# EAGLE design inav-7.1_fc (EAGLE 9.6.2)
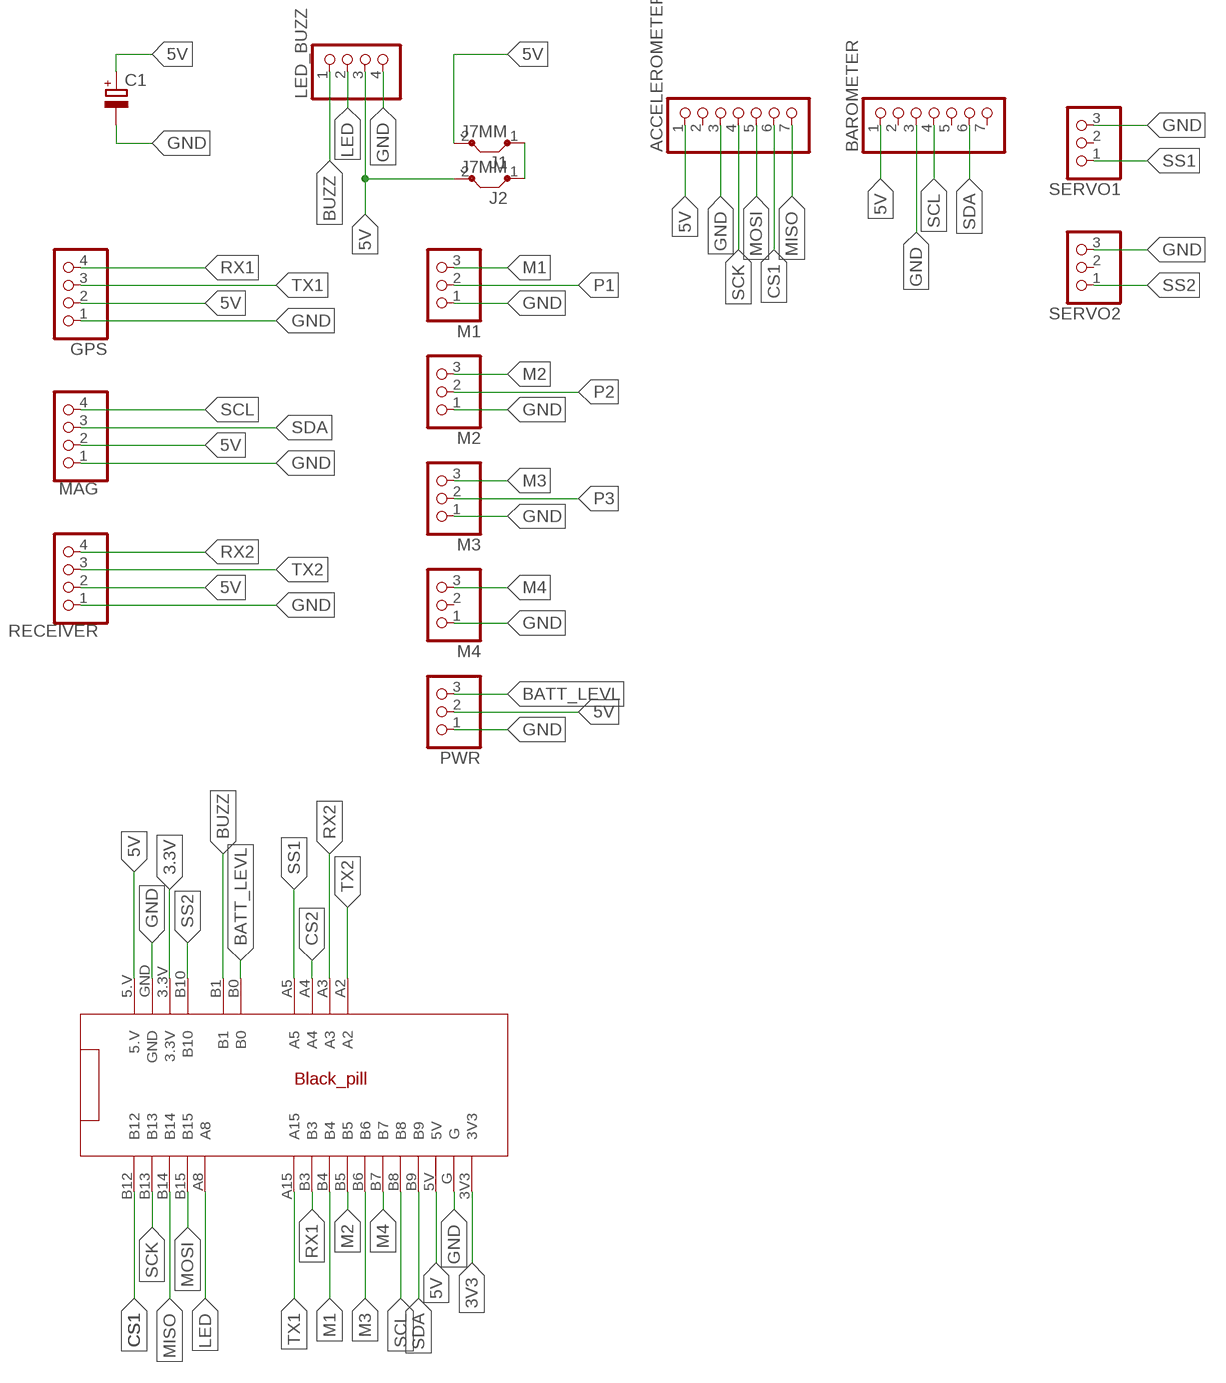
[diagram p0: schematic, sheet 1]

## Parts
ACCELEROMETER  PINHD-1X7  [1X07]
BAROMETER  PINHD-1X7  [1X07]
C1  CPOL-EUE3.5-8  [E3,5-8]
GPS  PINHD-1X4  [1X04]
J1  J7MM  [07]
J2  J7MM  [07]
LED_BUZZ  PINHD-1X4/OCT  [1X04/OCT]
M1  PINHD-1X3/OCT  [1X03/OCT]
M2  PINHD-1X3/OCT  [1X03/OCT]
M3  PINHD-1X3/OCT  [1X03/OCT]
M4  PINHD-1X3/OCT  [1X03/OCT]
MAG  QWIIC_RIGHT_ANGLE  PINHD-1X4  [1X04]
PWR  PINHD-1X3/OCT  [1X03/OCT]
RECEIVER  QWIIC_RIGHT_ANGLE  PINHD-1X4  [1X04]
SERVO1  PINHD-1X3/OCT  [1X03/OCT]
SERVO2  PINHD-1X3/OCT  [1X03/OCT]
U$1  BLACKPILL_FR_INAV7.1  [BLACKPILLBOARD]

## Nets
3.3V: U$1.3.3V
3V3: U$1.3V3
5V: ACCELEROMETER.1 BAROMETER.1 C1.+ GPS.2 J1.2 J2.2 LED_BUZZ.3 MAG.2 PWR.2 RECEIVER.2 U$1.5.V U$1.5V
BATT_LEVL: PWR.3 U$1.B0
BUZZ: LED_BUZZ.1 U$1.B1
CS1: ACCELEROMETER.6 U$1.B12
CS2: U$1.A4
GND: ACCELEROMETER.3 BAROMETER.3 C1.- GPS.1 LED_BUZZ.4 M1.1 M2.1 M3.1 M4.1 MAG.1 PWR.1 RECEIVER.1 SERVO1.3 SERVO2.3 U$1.G U$1.GND
LED: LED_BUZZ.2 U$1.A8
M1: M1.3 U$1.B4
M2: M2.3 U$1.B5
M3: M3.3 U$1.B6
M4: M4.3 U$1.B7
MISO: ACCELEROMETER.7 U$1.B14
MOSI: ACCELEROMETER.5 U$1.B15
N$1: J1.1 J2.1
P1: M1.2
P2: M2.2
P3: M3.2
RX1: GPS.4 U$1.B3
RX2: RECEIVER.4 U$1.A3
SCK: ACCELEROMETER.4 U$1.B13
SCL: BAROMETER.4 MAG.4 U$1.B8
SDA: BAROMETER.6 MAG.3 U$1.B9
SS1: SERVO1.1 U$1.A5
SS2: SERVO2.1 U$1.B10
TX1: GPS.3 U$1.A15
TX2: RECEIVER.3 U$1.A2
Unconnected: ACCELEROMETER.2 BAROMETER.2 BAROMETER.5 BAROMETER.7 M4.2 SERVO1.2 SERVO2.2

## Library data of the parts
ACCELEROMETER BAROMETER = pinhead:PINHD-1X7: PIN HEADER
C1 = rcl:CPOL-EU: POLARIZED CAPACITOR, European symbol; SPICEPREFIX: C
GPS MAG RECEIVER = pinhead:PINHD-1X4: PIN HEADER
J1 J2 = jumper:J: Bridge
LED_BUZZ = pinhead_v2:PINHD-1X4: PIN HEADER
M1-M4 PWR SERVO1 SERVO2 = pinhead_v2:PINHD-1X3: PIN HEADER
U$1 = blackpill_fr_inav7.1:BLACKPILL_FR_INAV7.1

## Board
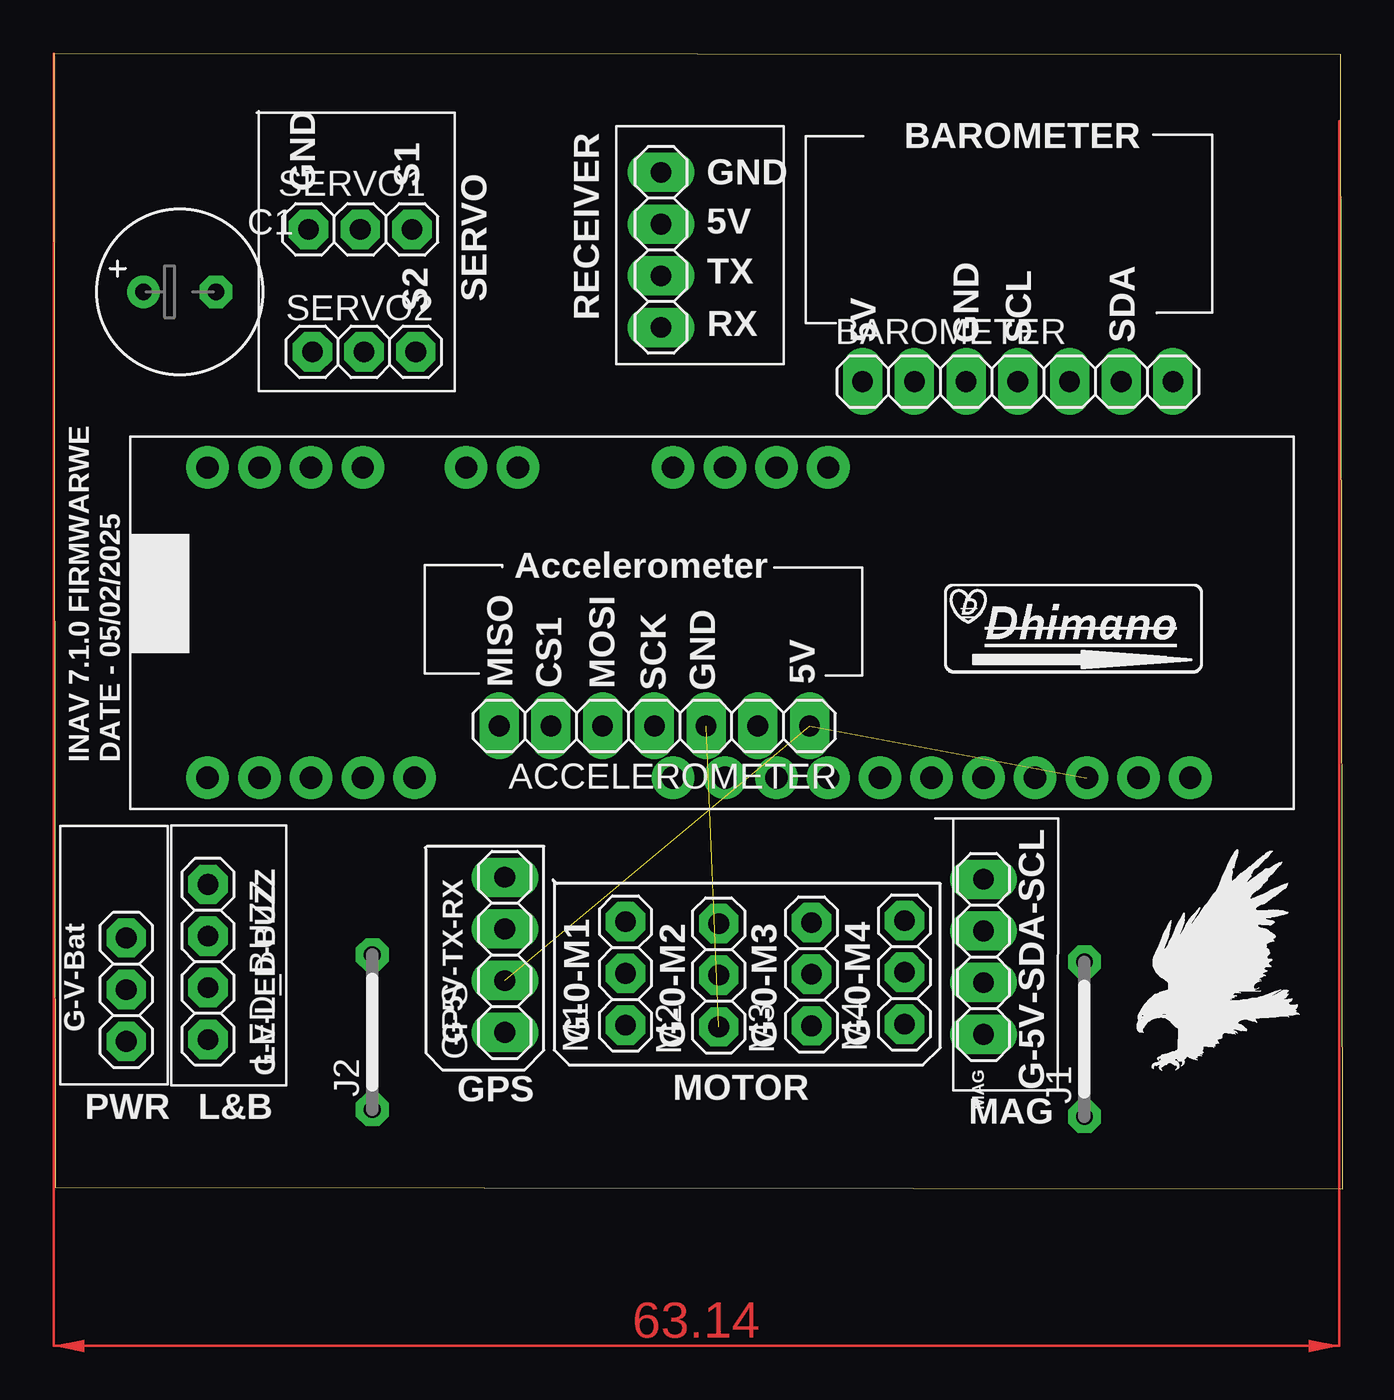
[diagram p1: board, top side]
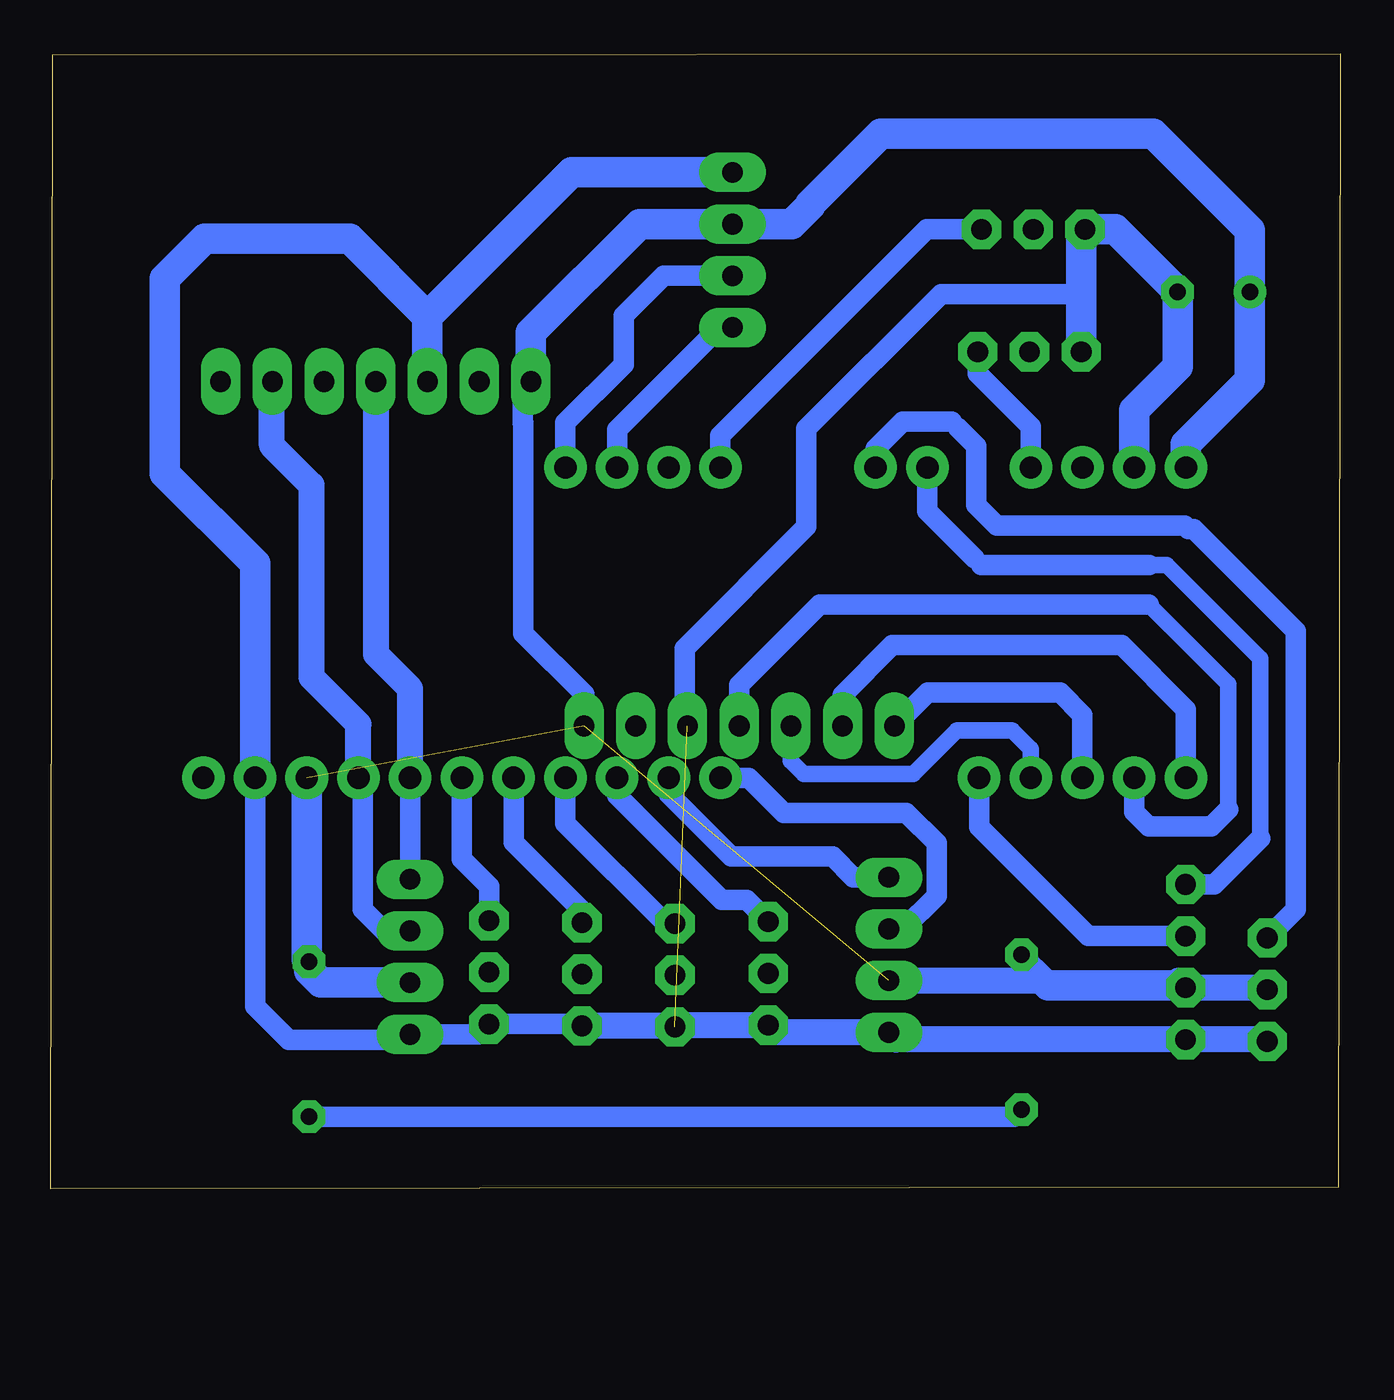
[diagram p2: board, bottom side, seen from below]

Size 63.31 x 55.77 mm. Coordinates in mm from the lower left corner, seen from the top.
Outline: 0.09,0.07 63.31,0 63.22,55.7 0,55.77 0.09,0.07
Copper layers (1*16): Top 0.035mm / dielectric 0.15mm / Bottom 0.035mm
Design rules "default *": minimum track width 16mil, minimum drill 0.35mm, track to track 6mil, track to pad 6mil, pad to pad 6mil, via to via 6mil, smd to smd 6mil, copper to edge 40mil, drill to drill 6mil, minimum pad ring 10mil, minimum via ring 8mil, stop-mask expansion 4mil, vias tented up to drill 0mil, thermal gap 10mil

### Footprints (pad centres in the part's own frame; a part is rotated, then mirrored left to right if it is on the bottom)
1X07 = drill 1.016 long: 1 -7.62,0; 2 -5.08,0; 3 -2.54,0; 4 0,0; 5 2.54,0; 6 5.08,0; 7 7.62,0
E3,5-8 = drill 0.813 pad 1.6: + -1.778,0 | drill 0.813 pad 1.6 octagon: - 1.778,0
1X04 = drill 1.016 long: 1 -3.81,0; 2 -1.27,0; 3 1.27,0; 4 3.81,0
07 = drill 0.813 pad 1.6 octagon: 1 -3.81,0; 2 3.81,0
1X04/OCT = drill 1.016 octagon: 1 -3.81,0; 2 -1.27,0; 3 1.27,0; 4 3.81,0
1X03/OCT = drill 1.016 octagon: 1 -2.54,0; 2 0,0; 3 2.54,0
BLACKPILLBOARD = drill 1.1 pad 1.93: 3.3V -15.24,7.62; 3V3 27.94,-7.62; 5.V -20.32,7.62; 5V 22.86,-7.62; A2 10.16,7.62; A3 7.62,7.62; A4 5.08,7.62; A5 2.54,7.62; A8 -10.16,-7.62; A15 2.54,-7.62; B0 -5.08,7.62; B1 -7.62,7.62; B3 5.08,-7.62; B4 7.62,-7.62; B5 10.16,-7.62; B6 12.7,-7.62; B7 15.24,-7.62; B8 17.78,-7.62; B9 20.32,-7.62; B10 -12.7,7.62; B12 -20.32,-7.62; B13 -17.78,-7.62; B14 -15.24,-7.62; B15 -12.7,-7.62; G 25.4,-7.62; GND -17.78,7.62

### Placement (x,y rotation side)
ACCELEROMETER  29.51,22.73 180 top
BAROMETER  47.36,39.65 0 top
C1  6.2,44.06 0 top
GPS  22.16,11.49 90 top
J1  50.63,7.34 90 top
J2  15.65,7.69 90 top
LED_BUZZ  7.58,11.14 270 top
M1  28.08,10.57 90 top
M2  32.67,10.48 90 top
M3  37.23,10.53 90 top
M4  41.79,10.63 90 top
MAG  45.68,11.39 90 top
PWR  3.57,9.77 90 top
RECEIVER  29.83,46.12 270 top
SERVO1  15.07,47.13 180 top
SERVO2  15.25,41.11 180 top
U$1  27.89,27.81 0 top
U$2  [EAGLE-PLC-8MM]  53.21,5.8 0 top
U$3  [DHIMAN_LOGO_13_MIL]  42.49,24.01 0 top

### Tracks (layer width: path | path; a pad name or v marks a point on that pad's centre or on a via)
5V  (2 unrouted)
  Bottom 1: BAROMETER.1 40.13,39.26 40.13,37.61 40.12,37.62 40.12,27.28 37.13,24.29 ACCELEROMETER.1
  Bottom 1.27: LED_BUZZ.3 7.93,10.22 | 6.25,9.87 LED_BUZZ.3 | PWR.2 3.66,9.87 LED_BUZZ.3 | 14.56,10.22 15.65,11.31 J2.2 | GPS.2 14.56,10.22 | 14.56,10.22 14.33,9.99
  Bottom 1.5: U$1.5.V 7.57,36.59 4.42,39.73 C1.+ 4.42,47.09 9.17,51.84 22.56,51.84 26.03,48.37 26.03,48.28 26.92,47.39 RECEIVER.2 34.4,47.39 39.74,42.04 BAROMETER.1 | MAG.2 50.06,10.12 50.63,10.69 J1.2 50.75,11.27 U$1.5V | LED_BUZZ.3 7.7,9.99 14.33,9.99
BATT_LEVL
  Bottom 0.5: 7.19,32.4 7.2,32.42 7.45,32.42 | 2.46,27.69 2.46,27.68
  Bottom 0.8: 18.76,37.37 19.07,37.69
  Bottom 1.016: PWR.3 2.17,13.71 2.17,27.4 2.46,27.69 | 2.46,27.68 7.19,32.4 | 7.45,32.42 7.62,32.59 16.85,32.59 17.85,33.59 17.85,36.47 18.76,37.37 | 19.07,37.69 21.48,37.69 22.81,36.36 U$1.B0
BUZZ
  Bottom 0.8: 17.63,30.65 17.97,30.99 | 3.92,17.2 3.92,26.05 8.51,30.65 9.36,30.65
  Bottom 1.016: LED_BUZZ.1 6.17,14.95 3.92,17.2 | U$1.B1 20.27,33.29 17.97,30.99 | 9.36,30.65 17.63,30.65
CS1
  Bottom 1.016: ACCELEROMETER.6 24.43,24.26 21.99,26.7 10.73,26.7 7.57,23.54 U$1.B12
GND  (1 unrouted)
  Bottom 1: 27.73,7.68 M1.1 | 32.58,8.03 M2.1 | M3.1 37.32,8.09 M4.1 42.3,7.58 MAG.1 45.96,7.3 51.63,7.3 53.29,8.96 U$1.G | 21.81,7.33 GPS.1 | 12.71,43.95 19.59,43.95 26.21,37.33 26.21,32.52 32.18,26.54 32.18,22.87 ACCELEROMETER.3
  Bottom 1.27: 21.81,7.33 LED_BUZZ.4 3.66,7.33 PWR.1 | GPS.1 27.73,7.68 | M1.1 32.58,8.03 | M2.1 32.72,7.99 M3.1
  Bottom 1.5: U$1.GND 10.11,38.25 7.98,40.38 C1.- 11.05,47.13 SERVO1.3 12.71,46.95 12.71,43.95 SERVO2.3 | RECEIVER.1 37.74,49.93 44.82,42.85 | 44.82,42.85 BAROMETER.3 | 44.82,42.85 48.63,46.67 55.75,46.67 57.71,44.7 57.71,35.13 53.29,30.7 U$1.G
LED
  Bottom 1: LED_BUZZ.2 12.36,12.41 17.73,17.78 U$1.A8
M1
  Bottom 1: M1.3 29.15,14.17 30.36,14.17 35.51,19.32 U$1.B4
M2
  Bottom 1: M2.3 33.12,13.02 38.05,17.94 U$1.B5
M3
  Bottom 1: M3.3 37.23,13.64 40.59,17 U$1.B6
M4
  Bottom 1: 43.13,16.18 41.79,14.85 M4.3
  Bottom 1.016: U$1.B7 43.13,16.18
MISO
  Bottom 1.016: ACCELEROMETER.7 20.26,24.36 13.74,24.36 12.65,23.27 U$1.B14
MOSI
  Bottom 0.8: U$1.B15 15.19,21.61 16.1,22.52 18.83,22.52 20.97,20.38 26.34,20.38 26.97,21.01 ACCELEROMETER.5
N$1
  Bottom 1: J2.1 15.99,3.54 50.33,3.54 50.34,3.53 J1.1
RX1
  Bottom 1: U$1.B3 32.97,19.39 29.89,16.31 24.91,16.31 23.9,15.3 GPS.4
RX2
  Bottom 1: RECEIVER.4 29.86,42.28 30.5,42.28 35.51,37.28 U$1.A3
SCK
  Bottom 0.8: 5.5,18.62 5.5,24.8 9.39,28.7
  Bottom 1.016: ACCELEROMETER.4 29.51,24.75 25.56,28.7 9.39,28.7 | U$1.B13 10.11,18.5 9.39,17.79 6.8,17.79 6.33,17.79 5.5,18.62
SCL
  Bottom 1: U$1.B8 45.67,15.86 45.68,15.85 MAG.4
  Bottom 1.27: BAROMETER.4 47.36,26.26 45.67,24.57 U$1.B8
SDA
  Bottom 1: U$1.B9 48.01,19.99 48.01,13.73 46.94,12.66 MAG.3 | 52.46,39.63 BAROMETER.6
  Bottom 1.27: U$1.B9 48.21,22.82 50.51,25.13 50.51,34.57 52.46,36.51 52.46,39.63
SS1
  Bottom 1: SERVO1.1 20.29,47.13 30.43,36.99 U$1.A5
SS2
  Bottom 1: U$1.B10 15.19,37.43 17.79,40.03 SERVO2.1
TX1
  Bottom 1: GPS.3 21.44,12.76 19.82,14.38 19.82,16.97 21.3,18.46 27.32,18.46 29.04,20.19 U$1.A15
TX2
  Bottom 1: RECEIVER.3 33.22,44.85 35.18,42.88 35.18,40.49 38.05,37.62 U$1.A2
(copper drawn outside any net)
  shapes: Top area x1

### Text on the board
tPlace: BAROMETER | GND | S1 | 5V | GND | SERVO | TX | S2 | RECEIVER | RX | 5V | SCL | SDA | GND | Accelerometer | MISO | CS1 | MOSI | 5V | SCK | GND | INAV 7.1.0 FIRMWARWE / DATE - 05/02/2025 | G-V-Bat | G-5V-TX-RX | G-0-M1 | G-0-M2 | G-0-M3 | G-0-M4 | G-V-LED-BUZZ | G-5V-SDA-SCL | GPS | MOTOR | PWR | L&B | MAG